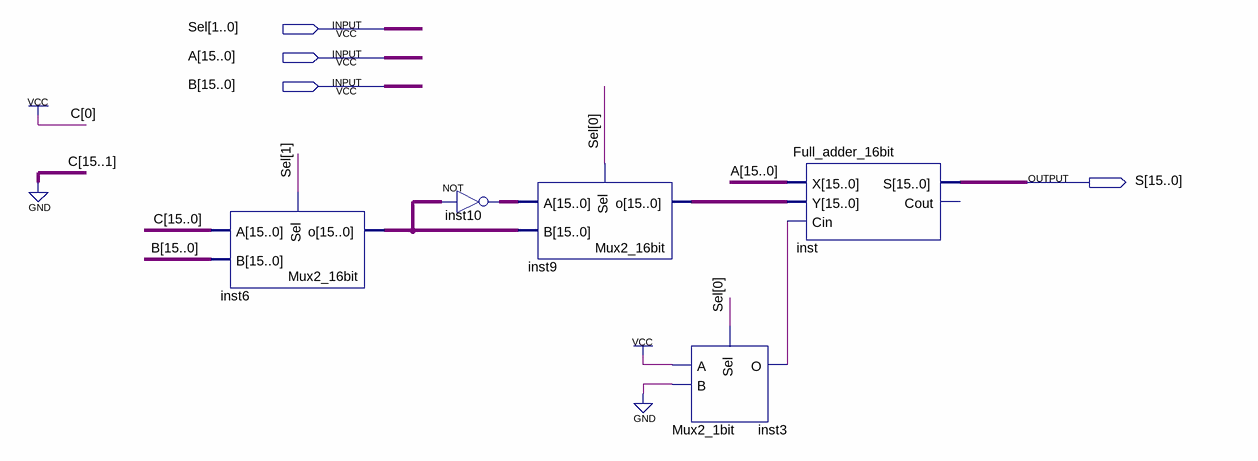
[diagram p0: schematic sheet]
// Quartus schematic Not_ALU1.bdf as structural Verilog: 5 symbols, 4 pins
module Not_ALU1 (
  input  [1:0] Sel,
  input  [15:0] A,
  input  [15:0] B,
  output [15:0] S
);

  wire inst3_o;
  wire [15:0] inst6_o, inst9_o, inst10_out;

  Mux2_16bit inst6 (.Sel(Sel[1]), .A(16'b0000000000000001), .B(B), .o(inst6_o));
  assign inst10_out = ~inst6_o;  // NOT inst10, 16 bits wide
  Mux2_16bit inst9 (.Sel(Sel[0]), .A(inst10_out), .B(inst6_o), .o(inst9_o));
  Mux2_1bit inst3 (.A(1'b1), .B(1'b0), .Sel(Sel[0]), .O(inst3_o));
  Full_adder_16bit inst (.X(A), .Y(inst9_o), .Cin(inst3_o), .S(S));  // open: Cout
endmodule
